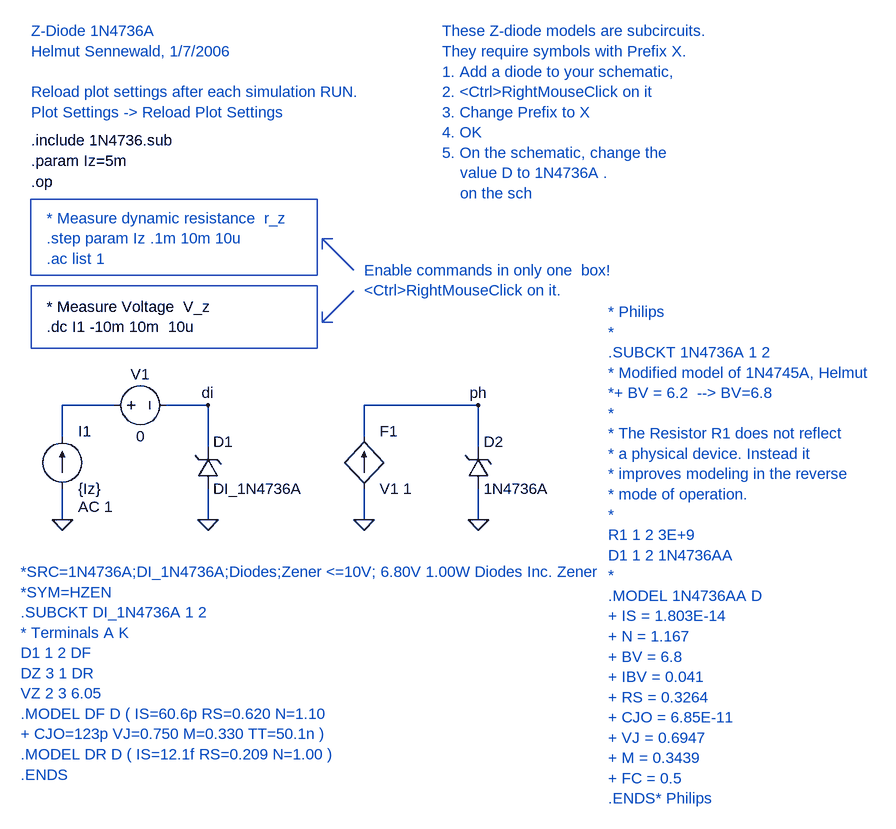
[diagram p0: schematic 1N4736A_test.asc]
1N4736A_test.asc, the LTspice schematic file:
Version 4
SHEET 1 1180 824
WIRE -208 160 -208 112
WIRE -208 288 -208 240
WIRE -128 112 -208 112
WIRE 16 112 -48 112
WIRE 16 176 16 112
WIRE 16 288 16 240
WIRE 256 160 256 112
WIRE 256 288 256 240
WIRE 432 112 256 112
WIRE 432 176 432 112
WIRE 432 288 432 240
FLAG 16 288 0
FLAG -208 288 0
FLAG 432 288 0
FLAG 256 288 0
FLAG 16 112 di
FLAG 432 112 ph
SYMBOL zener 0 240 M180
WINDOW 0 24 72 Left 0
WINDOW 3 24 0 Left 0
SYMATTR InstName D1
SYMATTR Value DI_1N4736A
SYMATTR Prefix X
SYMBOL current -208 240 M180
WINDOW 0 24 88 Left 0
WINDOW 3 24 0 Left 0
WINDOW 123 24 -28 Left 0
WINDOW 39 0 0 Left 0
SYMATTR InstName I1
SYMATTR Value {Iz}
SYMATTR Value2 AC 1
SYMBOL zener 416 240 M180
WINDOW 0 24 72 Left 0
WINDOW 3 24 0 Left 0
SYMATTR InstName D2
SYMATTR Value 1N4736A
SYMATTR Prefix X
SYMBOL f 256 240 M180
WINDOW 0 24 88 Left 0
WINDOW 3 24 0 Left 0
SYMATTR InstName F1
SYMATTR Value V1 1
SYMBOL voltage -144 112 M90
WINDOW 0 -32 56 VBottom 0
WINDOW 3 32 56 VTop 0
SYMATTR InstName V1
SYMATTR Value 0
TEXT -272 368 Left 0 ;*SRC=1N4736A;DI_1N4736A;Diodes;Zener <=10V; 6.80V 1.00W Diodes Inc. Zener\n*SYM=HZEN\n.SUBCKT DI_1N4736A 1 2\n* Terminals A K\nD1 1 2 DF\nDZ 3 1 DR\nVZ 2 3 6.05\n.MODEL DF D ( IS=60.6p RS=0.620 N=1.10\n+ CJO=123p VJ=0.750 M=0.330 TT=50.1n )\n.MODEL DR D ( IS=12.1f RS=0.209 N=1.00 )\n.ENDS
TEXT -256 -232 Left 0 !.op
TEXT -232 -40 Left 0 !* Measure Voltage  V_z \n.dc I1 -10m 10m  10u
TEXT -256 -464 Left 0 ;Z-Diode 1N4736A\nHelmut Sennewald, 1/7/2006\n \nReload plot settings after each simulation RUN.\nPlot Settings -> Reload Plot Settings
TEXT -256 -296 Left 0 !.include 1N4736.sub
TEXT 632 -32 Left 0 ;* Philips\n*\n.SUBCKT 1N4736A 1 2 \n* Modified model of 1N4745A, Helmut \n*+ BV = 6.2  --> BV=6.8\n*\n* The Resistor R1 does not reflect \n* a physical device. Instead it\n* improves modeling in the reverse \n* mode of operation.\n*\nR1 1 2 3E+9 \nD1 1 2 1N4736AA\n*\n.MODEL 1N4736AA D \n+ IS = 1.803E-14 \n+ N = 1.167 \n+ BV = 6.8 \n+ IBV = 0.041 \n+ RS = 0.3264 \n+ CJO = 6.85E-11 \n+ VJ = 0.6947 \n+ M = 0.3439 \n+ FC = 0.5 \n.ENDS* Philips
TEXT -232 -176 Left 0 ;* Measure dynamic resistance  r_z\n.step param Iz .1m 10m 10u\n.ac list 1
TEXT -256 -264 Left 0 !.param Iz=5m
TEXT 256 -96 Left 0 ;Enable commands in only one  box!\n<Ctrl>RightMouseClick on it.
TEXT 376 -464 Left 0 ;These Z-diode models are subcircuits.\nThey require symbols with Prefix X.\n1. Add a diode to your schematic,\n2. <Ctrl>RightMouseClick on it\n3. Change Prefix to X\n4. OK\n5. On the schematic, change the \n    value D to 1N4736A .\n    on the sch
LINE Normal 240 -64 192 -16
LINE Normal 192 -144 240 -96
LINE Normal 208 -144 192 -144
LINE Normal 192 -128 192 -144
LINE Normal 208 -16 192 -16
LINE Normal 192 -32 192 -16
RECTANGLE Normal 184 -88 -257 -205
RECTANGLE Normal 184 24 -256 -72

The netlist it stands for:
* 1N4736A_test.asc
XD1 0 di DI_1N4736A  ; pins + -
I1 0 N001 {Iz} AC 1
XD2 0 ph 1N4736A  ; pins + -
F1 0 ph V1 1
V1 N001 di 0
* *SRC=1N4736A;DI_1N4736A;Diodes;Zener <=10V; 6.80V 1.00W Diodes Inc. Zener
* *SYM=HZEN
* .SUBCKT DI_1N4736A 1 2
* * Terminals A K
* D1 1 2 DF
* DZ 3 1 DR
* VZ 2 3 6.05
* .MODEL DF D ( IS=60.6p RS=0.620 N=1.10
* + CJO=123p VJ=0.750 M=0.330 TT=50.1n )
* .MODEL DR D ( IS=12.1f RS=0.209 N=1.00 )
* .ENDS
.op
* Measure Voltage  V_z
.dc I1 -10m 10m  10u
* Z-Diode 1N4736A
* Helmut Sennewald, 1/7/2006
* Reload plot settings after each simulation RUN.
* Plot Settings -> Reload Plot Settings
.include 1N4736.sub
* * Philips
* *
* .SUBCKT 1N4736A 1 2
* * Modified model of 1N4745A, Helmut
* *+ BV = 6.2  --> BV=6.8
* *
* * The Resistor R1 does not reflect
* * a physical device. Instead it
* * improves modeling in the reverse
* * mode of operation.
* *
* R1 1 2 3E+9
* D1 1 2 1N4736AA
* *
* .MODEL 1N4736AA D
* + IS = 1.803E-14
* + N = 1.167
* + BV = 6.8
* + IBV = 0.041
* + RS = 0.3264
* + CJO = 6.85E-11
* + VJ = 0.6947
* + M = 0.3439
* + FC = 0.5
* .ENDS* Philips
* * Measure dynamic resistance  r_z
* .step param Iz .1m 10m 10u
* .ac list 1
.param Iz=5m
* Enable commands in only one  box!
* <Ctrl>RightMouseClick on it.
* These Z-diode models are subcircuits.
* They require symbols with Prefix X.
* 1. Add a diode to your schematic,
* 2. <Ctrl>RightMouseClick on it
* 3. Change Prefix to X
* 4. OK
* 5. On the schematic, change the
*     value D to 1N4736A .
*     on the sch
.backanno
.end